# Altium schematic sheet DDR3.SchDoc
size 420 x 297 mm; SheetNumber: 8; SheetTotal: 12
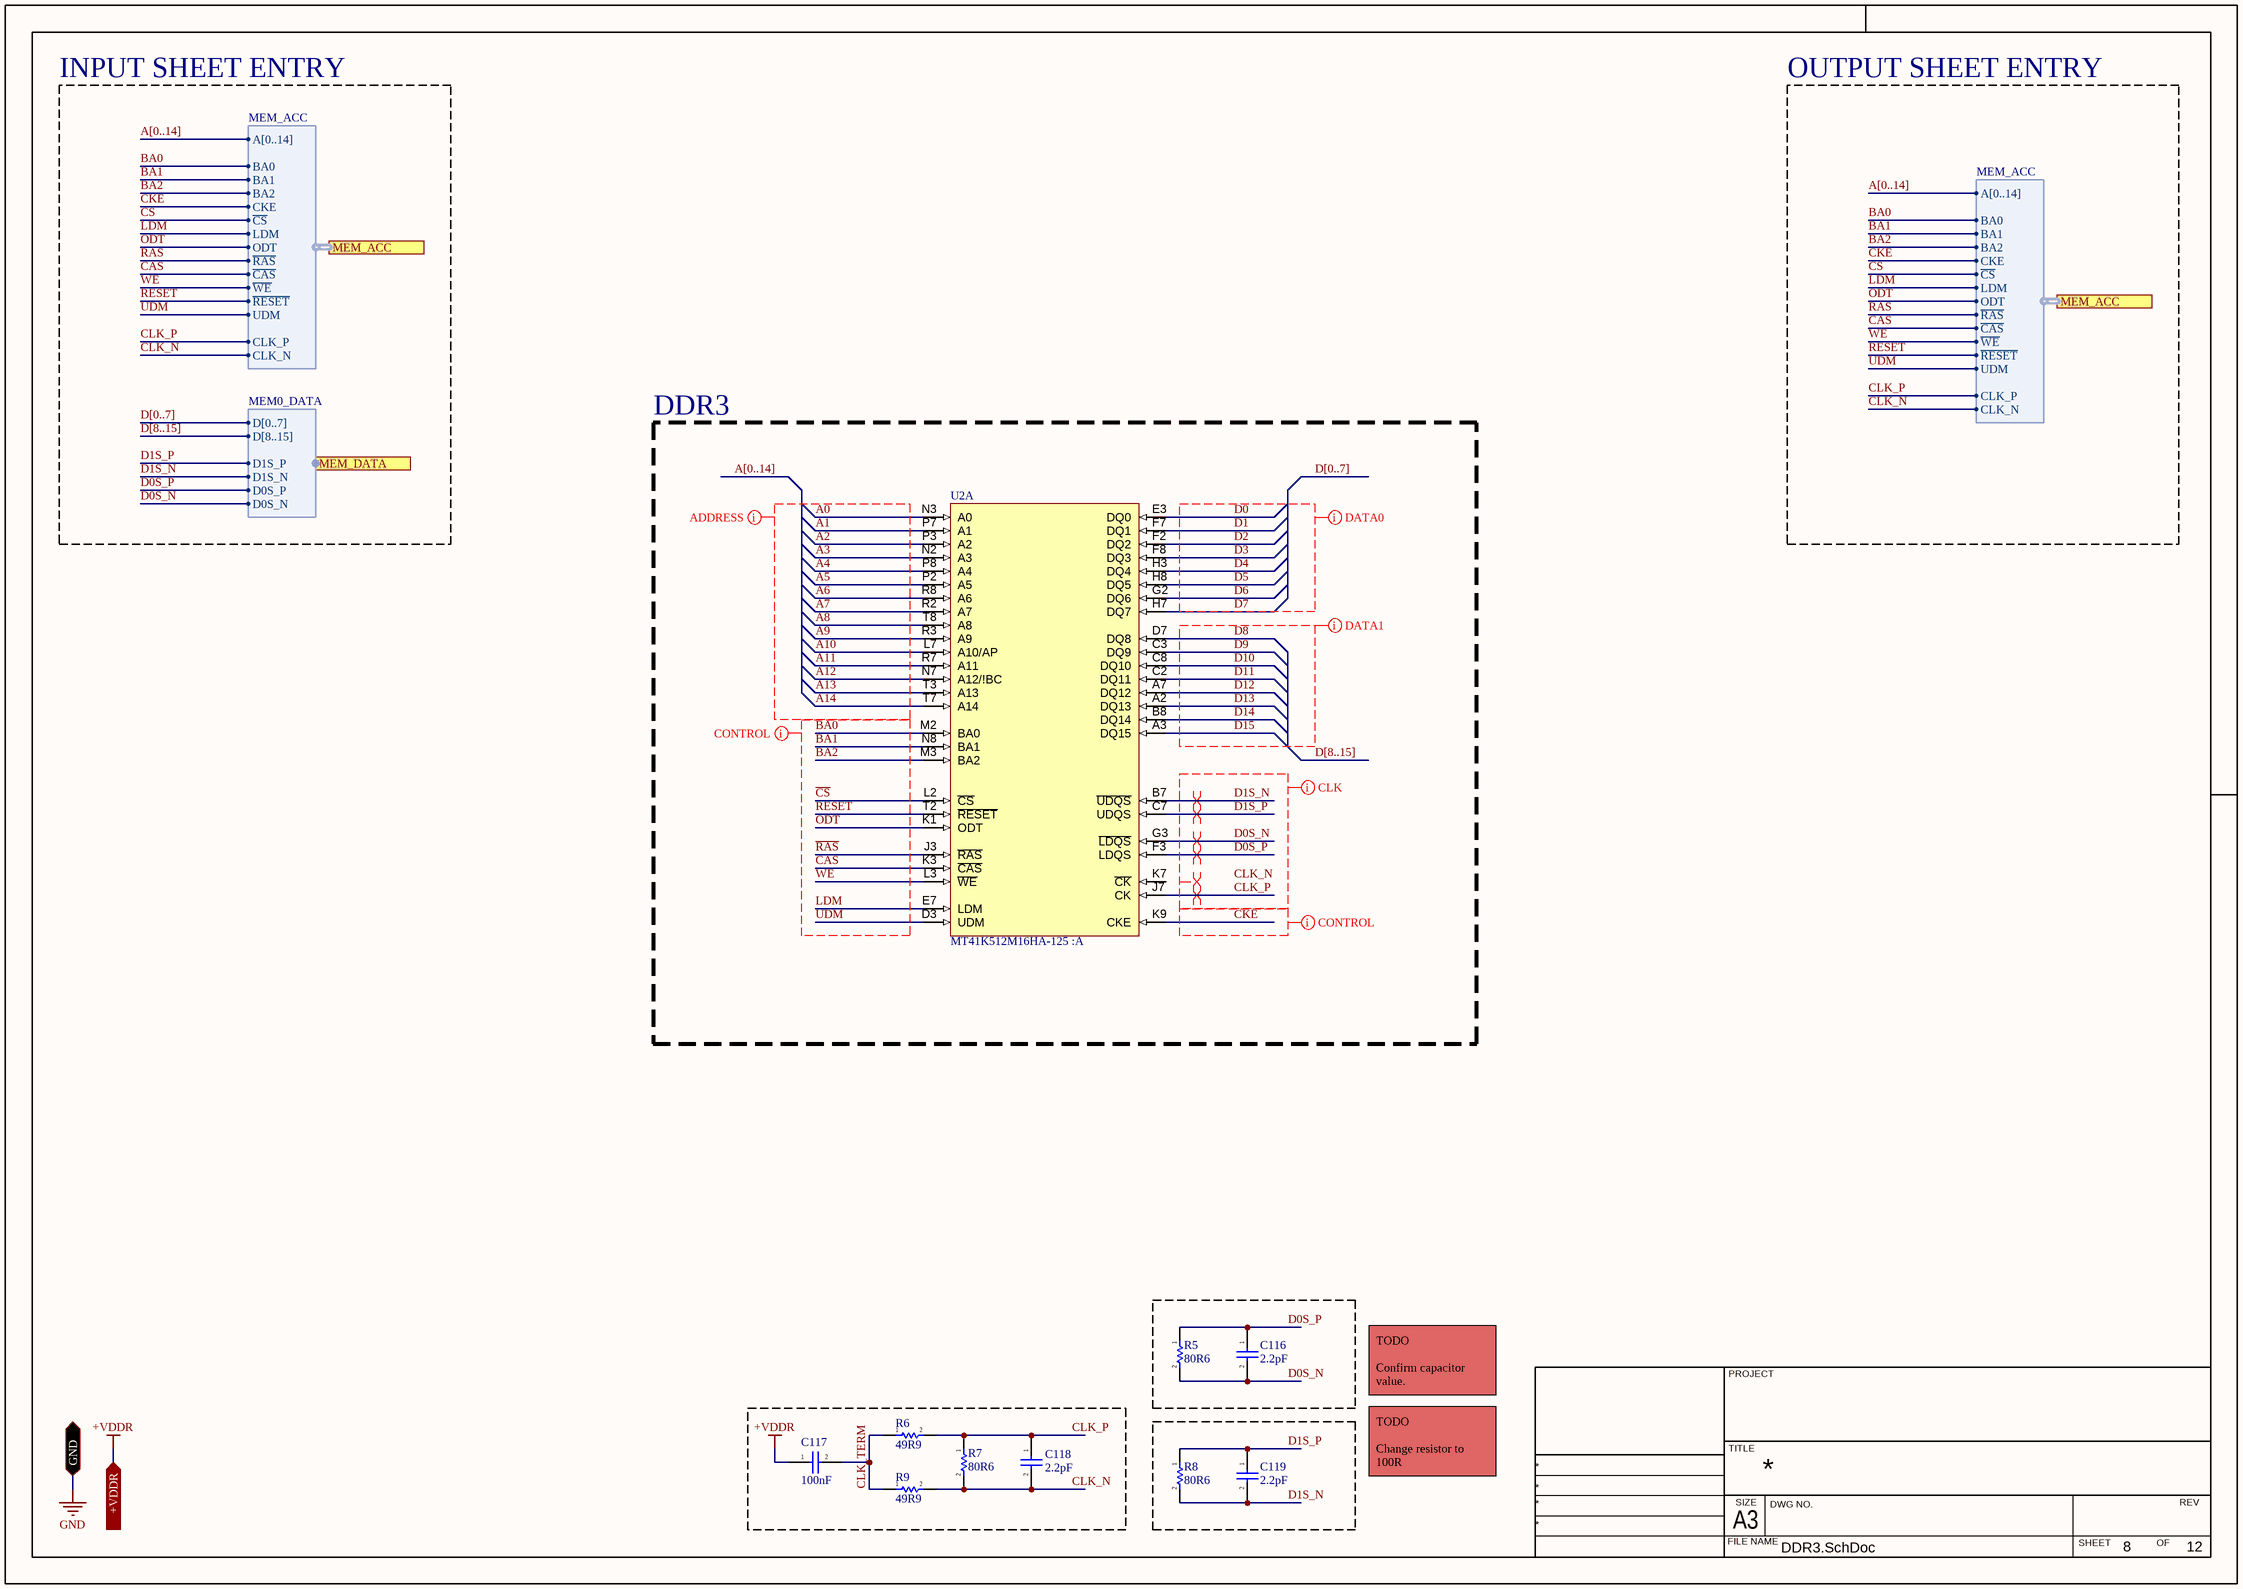
[diagram p0: DDR3.SchDoc]

## Parts
C116  2.2pF  [CAP_0402]
C117  100nF  [CAP_0402]
C118  2.2pF  [CAP_0402]
C119  2.2pF  [CAP_0402]
R5  80R6  [RES_0402]
R6  49R9  [RES_0402]
R7  80R6  [RES_0402]
R8  80R6  [RES_0402]
R9  49R9  [RES_0402]
U2  MT41K512M16HA-125 :A  [FBGA-96]  (part A of 3)

## Blocks framed on the sheet
DDR3: U2

## Ports
+VDDR (in), GND (bidir), MEM_ACC (harness MEM_ACC), MEM_DATA (harness MEM0_DATA)

## Harnesses
MEM_ACC: BA0, BA1, BA2, CKE, ~{CS}, LDM, ODT, ~{RAS}, ~{CAS}, ~{WE}, ~{RESET}, UDM, CLK_N, CLK_P, A[0..14]
MEM0_DATA: D[8..15], D0S_N, D0S_P, D1S_N, D1S_P, D[0..7]

## Nets
+VDDR: C117.1 ; port +VDDR
GND: port GND
~{CAS}: U2.K3(~{CAS}) ; port MEM_ACC.~{CAS}
~{CS}: U2.L2(~{CS}) ; port MEM_ACC.~{CS}
~{RAS}: U2.J3(~{RAS}) ; port MEM_ACC.~{RAS}
~{RESET}: U2.T2(~{RESET}) ; port MEM_ACC.~{RESET}
~{WE}: U2.L3(~{WE}) ; port MEM_ACC.~{WE}
A0: U2.N3(A0)
A1: U2.P7(A1)
A2: U2.P3(A2)
A3: U2.N2(A3)
A4: U2.P8(A4)
A5: U2.P2(A5)
A6: U2.R8(A6)
A7: U2.R2(A7)
A8: U2.T8(A8)
A9: U2.R3(A9)
A10: U2.L7(A10/AP)
A11: U2.R7(A11)
A12: U2.N7(A12/!BC)
A13: U2.T3(A13)
A14: U2.T7(A14)
BA0: U2.M2(BA0) ; port MEM_ACC.BA0
BA1: U2.N8(BA1) ; port MEM_ACC.BA1
BA2: U2.M3(BA2) ; port MEM_ACC.BA2
CKE: U2.K9(CKE) ; port MEM_ACC.CKE
CLK_N: C118.2 R7.2 R9.2 ; port MEM_ACC.CLK_N
CLK_P: C118.1 R6.2 R7.1 U2.J7(CK) ; port MEM_ACC.CLK_P
CLK_TERM: C117.2 R6.1 R9.1
D0: U2.E3(DQ0)
D0S_N: C116.2 R5.2 U2.G3(~{LDQS}) ; port MEM_DATA.D0S_N
D0S_P: C116.1 R5.1 U2.F3(LDQS) ; port MEM_DATA.D0S_P
D1: U2.F7(DQ1)
D1S_N: C119.2 R8.2 U2.B7(~{UDQS}) ; port MEM_DATA.D1S_N
D1S_P: C119.1 R8.1 U2.C7(UDQS) ; port MEM_DATA.D1S_P
D2: U2.F2(DQ2)
D3: U2.F8(DQ3)
D4: U2.H3(DQ4)
D5: U2.H8(DQ5)
D6: U2.G2(DQ6)
D7: U2.H7(DQ7)
D8: U2.D7(DQ8)
D9: U2.C3(DQ9)
D10: U2.C8(DQ10)
D11: U2.C2(DQ11)
D12: U2.A7(DQ12)
D13: U2.A2(DQ13)
D14: U2.B8(DQ14)
D15: U2.A3(DQ15)
LDM: U2.E7(LDM) ; port MEM_ACC.LDM
ODT: U2.K1(ODT) ; port MEM_ACC.ODT
UDM: U2.D3(UDM) ; port MEM_ACC.UDM

Not connected (* = marked no-connect by the designer): U2 K7(~{CK})

## Buses and harness runs
bus A[0..14]
bus D[0..7]
bus D[8..15]

## Layout directives
net class ACC; net class ADDRESS: A0, A1, A2, A3, A4, A5, A6, A7, A8, A9, A10, A11, A12, A13, A14
net class ACC; net class CONTROL: BA0, BA1, BA2, CKE, LDM, ODT, UDM, ~{CAS}, ~{CS}, ~{RAS}, ~{RESET}, ~{WE}
net class CLK; net class ACC: CLK_N, CLK_P, D0S_N, D0S_P, D1S_N, D1S_P
net class DATA; net class DATA0: D0, D1, D2, D3, D4, D5, D6, D7
net class DATA; net class DATA1: D8, D9, D10, D11, D12, D13, D14, D15
differential pair: CLK_N, CLK_P, D0S_N, D0S_P, D1S_N, D1S_P

## Notes on the sheet
- INPUT SHEET ENTRY
- OUTPUT SHEET ENTRY
- TODO
  Confirm capacitor value.
- TODO
  Change resistor to 100R
- Labels drawn without touching a wire or pin: CLK_N
- PROJECT
- TITLE
- FILE NAME
- A3
- SIZE
- DWG NO.
- SHEET
- OF
- REV

## Library data of the parts
C116-C119 = CAP_CER: Generic SMT Ceramic Capacitor; Voltage - Rated: 25V; Operating Temperature: *; Tolerance: *; Mfr: *; ComponentLink1Description: Digikey; ComponentLink1URL: [Digikey Link]; Digikey Part No: *; ComponentLink2Description: Datasheet; ComponentLink2URL: [Datasheet Link]; Footprint: 0402
R5-R9 = RESISTOR: Power: 1/8W; Tolerance: 0.5%; Automotive: *; Operating Temperature: *; Package / Case: 0402; # Digikey: *; ComponentLink1Description: Digikey; ComponentLink1URL: *; # Manufacturer: *
U2 = IC_MT41K512M16HA-125: DRAM 8G 1.35V 512Mx16 800 MHz DDR3 0C-90C; Mfr: Alliance Memory; Data Bus Width: 16 bits; Memory Size: 8Gb; Maximum Clock Frequency: 800MHz; Supply Voltage (Max): 1.45V; Supply Voltage (Min): 1.283V; Supply Current (Max): 88mA; Package / Case: FBGA-96; Type: SDRAM - DDR3L; Memory Organization: 512M x 16; Operating Temperature: 0C - 95C